# EasyEDA Pro project 减速无刷电机FOC1.0.epro, board PCB1
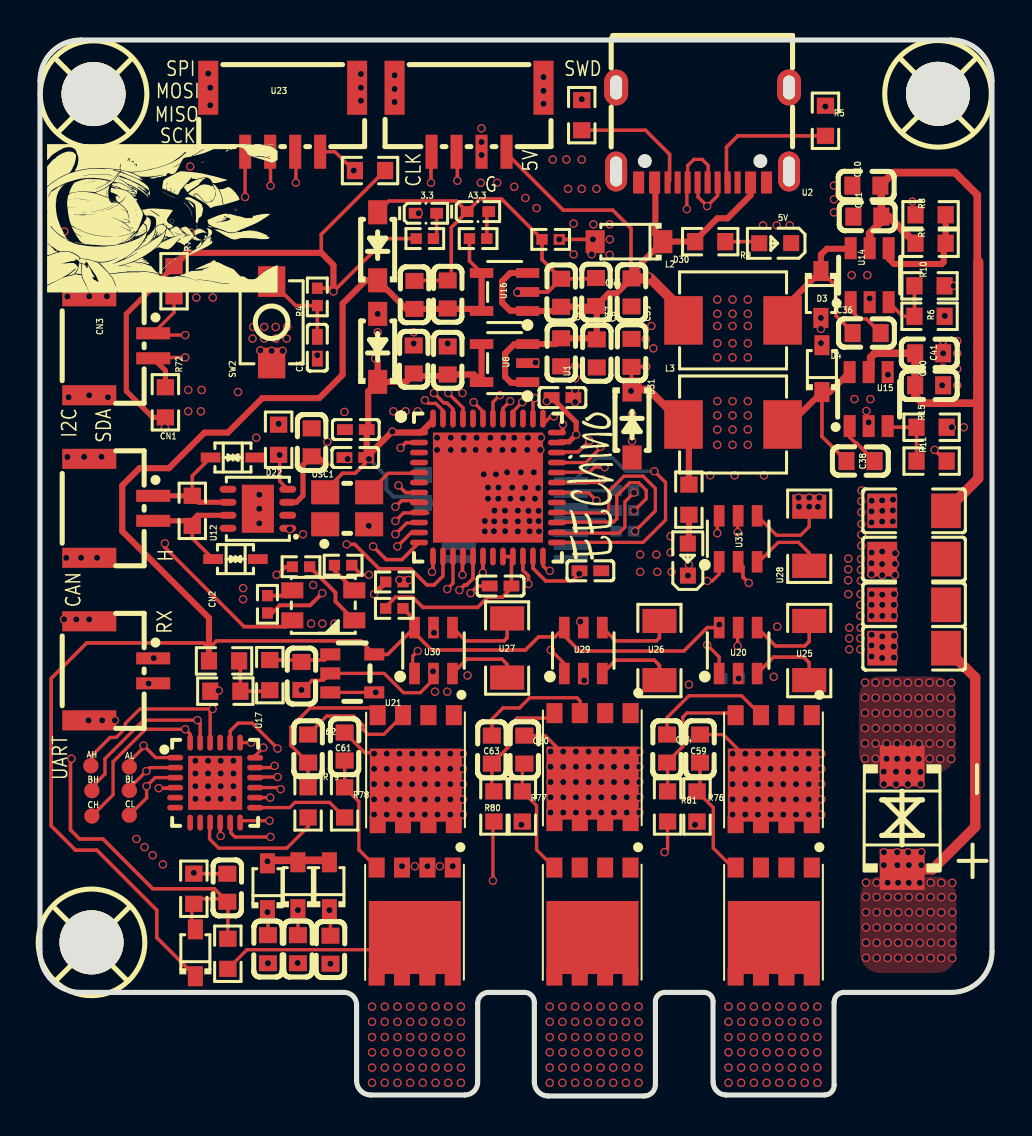
[diagram p1: board, top side]
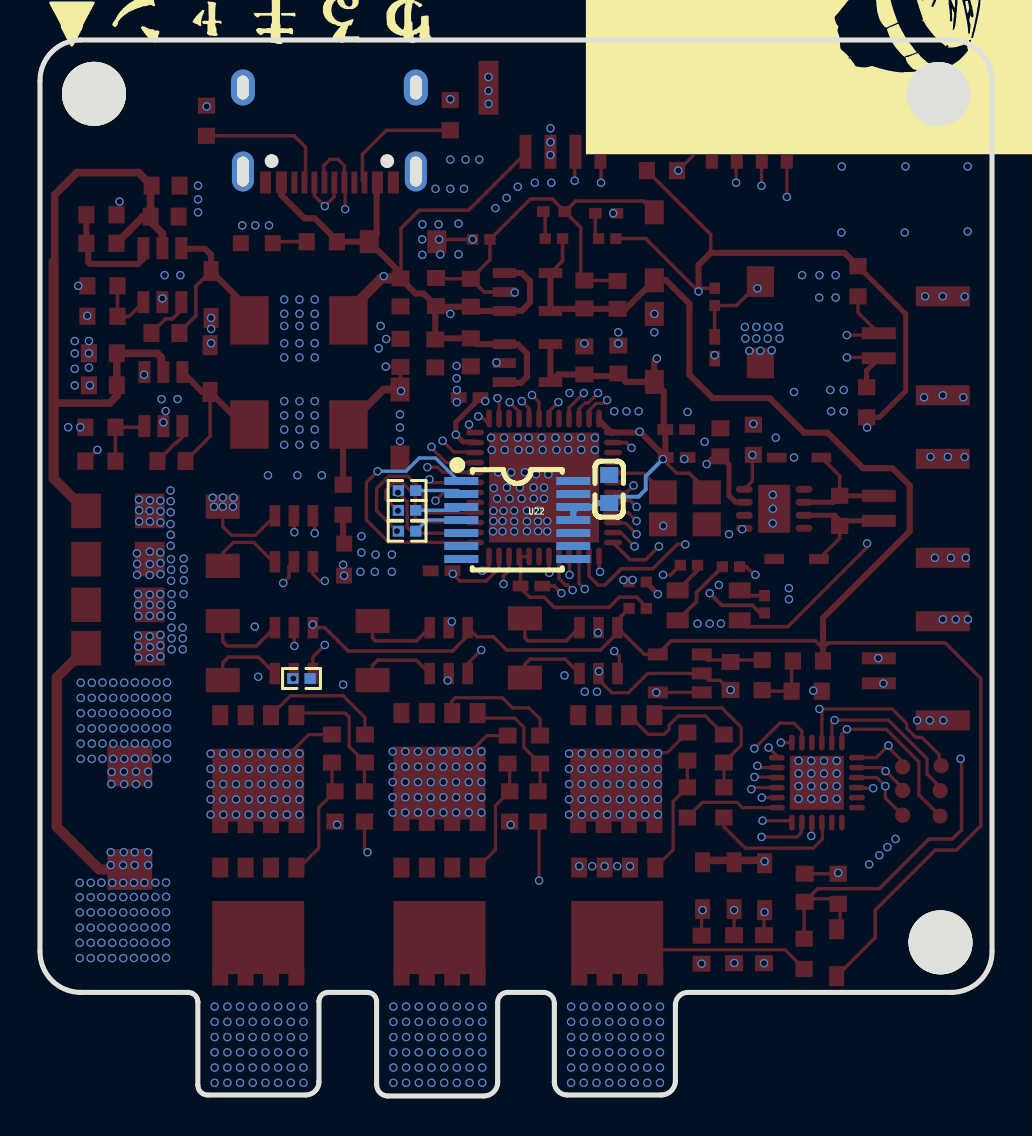
[diagram p2: board, bottom side, seen from below]

Outline 47.62 x 52.81 mm; copper layers: Top Layer, Inner1, Inner2, Bottom Layer. Coordinates in mm from the lower left corner of the outline.
Outline path: 0,50.77 0,7.21 arc(0.6,5.78) 2.03,5.18 15.21,5.18 arc(15.66,5) 15.84,4.56 15.84,0.76 arc(16.05,0.26) 16.55,0.05 21.26,0.05 arc(21.71,0.24) 21.9,0.69 21.9,4.63 arc(22.06,5.02) 22.44,5.18 24.23,5.18 arc(24.58,5.04) 24.73,4.69 24.73,0.7 arc(24.93,0.2) 25.43,0 30.22,0 arc(30.62,0.17) 30.78,0.57 30.78,4.71 arc(30.92,5.04) 31.25,5.18 33.21,5.18 arc(33.54,5.05) 33.67,4.73 33.67,0.71 arc(33.86,0.24) 34.33,0.05 39.24,0.05 arc(39.58,0.19) 39.73,0.53 39.73,4.69 arc(39.87,5.04) 40.22,5.18 45.59,5.18 arc(47.03,5.78) 47.62,7.21 47.62,50.77 arc(47.03,52.21) 45.59,52.81 2.03,52.81 arc(0.6,52.21) 0,50.77
Stack: Top Layer 0.035mm 外层铜厚1oz / Dielectric1 0.2104mm 7628 RC49% 8.6mil / Inner1 0.0152mm 内层铜厚 / Dielectric2 1.065mm 1.1mm H/HOZ 含铜 / Inner2 0.0152mm 内层铜厚 / Dielectric3 0.2104mm 7628 RC49% 8.6mil / Bottom Layer 0.035mm 外层铜厚1oz

## Design rules (mm)
template: 自定义配置
spacing copperThickness1oz (default): track to track 0.102, other pairs 0.152 to 0.3
spacing copperThickness2oz: track to track 0.203, other pairs 0.152 to 0.3
track width copperThickness1oz (default): min 0.127, default 0.254, max 2.54
track width copperThickness2oz: min 0.203, default 0.254, max 2.54
differential pair differentialPair (default): width min 0.127, default 0.254, max 2.54; gap min 0.152, default 0.152
via viaSize (default): diameter min 0.409, default 0.409, max 10; hole min 0.3, default 0.305, max 6.299
pour e147 uses copperRegion
pour e206 uses copperRegion
pour e208 uses copperRegion
pour e547 uses copperRegion
pour e636 uses copperRegion
pour e638 uses copperRegion
pour e2378 uses copperRegion
pour e2946 uses copperRegion
pour e2948 uses copperRegion
pour e4550 uses copperRegion
pour e4593 uses copperRegion
pour e4630 uses copperRegion

## Placement (name value [footprint] x y rotation side)
3.3  -  [LED_0402]  19.31 44.14 0 top
5V  LTST-C191KRKT  [LED0603-RD]  36.78 42.65 180 top
A3.3  -  [LED_0402]  21.91 44.22 0 top
AH  -  [test-point-0.5mm]  2.55 16.52 0 top
AL  -  [test-point-0.5mm]  4.47 16.46 0 top
BH  -  [test-point-0.5mm]  2.6 15.27 0 top
BL  -  [test-point-0.5mm]  4.47 15.28 0 top
C3  100nF  [C0402]  13.87 37.42 90 top
C7  100nF  [C0603]  18.69 36.83 270 top
C8  10uF  [C0603]  27.85 37.13 270 top
C10  4.7uF  [C0603]  41.34 45.52 0 top
C11  10uF  [C0603]  41.39 43.98 0 top
C25  100nF  [C0603]  26.07 37.19 270 top
C26  10uF  [C0603]  20.39 36.78 270 top
C35  100nF  [C0603]  13.59 32.69 90 top
C36  100nF  [C0603]  41.35 38.15 0 top
C37  10uF  [C0603]  29.59 40.18 90 top
C38  100nF  [C0603]  41.05 31.75 0 top
C39  10uF  [C0603]  29.59 37.16 270 top
C40  4.7uF  [C0603]  44.48 35.54 180 top
C41  10uF  [C0603]  44.48 37.14 180 top
C42  100nF  [C0603]  26.07 40.17 90 top
C43  10uF  [C0603]  20.39 40.08 270 top
C44  100nF  [C0603]  18.73 40.06 270 top
C45  10uF  [C0603]  27.81 40.21 90 top
C55  100nF  [C0603]  19.15 30.35 90 bottom
C56  100nF  [C0603]  14.53 7.32 270 top
C57  100nF  [C0603]  12.9 7.34 270 top
C58  100nF  [C0603]  11.4 7.34 270 top
C59  1nF  [C0603]  33.02 17.37 90 top
C60  1nF  [C0603]  24.23 17.32 90 top
C61  1nF  [C0603]  15.24 17.48 90 top
C62  1nF  [C0603]  13.42 17.37 90 top
C63  1nF  [C0603]  22.61 17.32 90 top
C64  1nF  [C0603]  31.37 17.37 90 top
C65  100nF  [C0603]  13.08 21.01 90 top
C70  100nF  [C0603]  9.37 10.41 90 top
C71  100nF  [C0402]  26.14 34.92 180 top
C72  100nF  [C0402]  27.53 26.26 180 top
C73  100nF  [C0402]  15.77 31.93 0 top
C74  4.7uF  [C0402]  15.8 33.32 0 top
C75  100nF  [C0402]  23.04 25.5 0 top
C78  100uF  [C1206]  43.73 29.26 0 top
C79  100uF  [C1206]  43.73 22.39 0 top
C80  100uF  [C1206]  43.73 24.56 0 top
C81  100uF  [C1206]  43.73 26.85 0 top
CH  -  [test-point-0.5mm]  2.6 14 0 top
CL  -  [test-point-0.5mm]  4.47 14.04 0 top
CN1  GH1.25-2P卧贴  [CONN-SMD_2P-P1.25_X1251WRS-02HF-LPSW]  4.06 29.39 270 top
CN2  GH1.25-2P卧贴  [CONN-SMD_2P-P1.25_X1251WRS-02HF-LPSW]  4.06 21.26 270 top
CN3  GH1.25-2P卧贴  [CONN-SMD_2P-P1.25_X1251WRS-02HF-LPSW]  4.06 37.52 270 top
D3  1N5819WS  [SOD-323_L1.8-W1.3-LS2.5-RD]  39.06 40.08 270 top
D4  1N5819WS  [SOD-323_L1.8-W1.3-LS2.5-RD]  39.12 36.37 90 top
D21  PESD3V3L1BA-N  [SOD-323_L1.8-W1.3-LS2.5-BI]  9.78 26.85 0 top
D22  PESD3V3L1BA-N  [SOD-323_L1.8-W1.3-LS2.5-BI]  9.65 31.93 180 top
D24  BZT52C3V3  [SOD-123_L2.7-W1.6-LS3.7-RD-1]  16.89 37.41 90 top
D25  BZT52C3V3  [SOD-123_L2.7-W1.6-LS3.7-RD-1]  16.89 42.49 90 top
D26  1N5819WS  [SOD-323_L1.8-W1.3-LS2.5-RD]  14.48 10.52 90 top
D27  1N5819WS  [SOD-323_L1.8-W1.3-LS2.5-RD]  12.9 10.52 90 top
D28  1N5819WS  [SOD-323_L1.8-W1.3-LS2.5-RD]  11.38 10.46 90 top
D30  BZT52C5V1  [SOD-123_L2.8-W1.8-LS3.7-RD-1]  29.46 42.72 180 top
D31  BZT52C13  [SOD-123_L2.7-W1.6-LS3.7-RD-1]  29.62 33.63 270 top
D32  1N5819WS  [SOD-323_L1.8-W1.3-LS2.5-RD]  7.77 7.16 90 top
D33  SMBJ18CA  [SMB_L4.6-W3.6-LS5.3-BI]  43.13 13.92 270 top
L2  4.7uH  [IND-SMD_L5.2-W4.7_GPSR0520]  34.67 38.79 0 top
L3  4.7uH  [IND-SMD_L5.2-W4.7_GPSR0520]  34.67 33.58 0 top
LED4  LTST-C191KRKT  [LED0603-RD]  32.41 26.82 90 top
LED7  XL-3528RGBW-HM  [LED-SMD_4P-L3.2-W2.8-LS3.5-BL-CW]  14.17 24.54 0 top
OSC1  8MHz  [OSC-SMD_4P-L3.2-W2.5-BL-1]  15.37 29.39 0 top
Q11  CJAC40N04  [CY_PDFNWB-8L_L5.8-W4.9-P1.27-BL-EP]  36.7 8.69 180 top
Q16  CJAC40N04  [CY_PDFNWB-8L_L5.8-W4.9-P1.27-BL-EP]  36.7 16.31 180 top
Q17  CJAC40N04  [CY_PDFNWB-8L_L5.8-W4.9-P1.27-BL-EP]  27.64 16.41 180 top
Q18  CJAC40N04  [CY_PDFNWB-8L_L5.8-W4.9-P1.27-BL-EP]  27.63 8.69 180 top
Q19  CJAC40N04  [CY_PDFNWB-8L_L5.8-W4.9-P1.27-BL-EP]  18.75 8.69 180 top
Q20  CJAC40N04  [CY_PDFNWB-8L_L5.8-W4.9-P1.27-BL-EP]  18.8 16.31 180 top
R4  10K  [R0402]  13.87 39.96 90 top
R5  5.1K  [R0603]  39.29 48.77 90 top
R6  124K  [R0603]  44.5 38.99 0 top
R7  100K  [R0603]  44.55 42.64 180 top
R8  100K  [R0603]  44.55 44.07 180 top
R9  10K  [R0603]  33.53 42.72 180 top
R10  23k  [R0603]  44.5 40.51 180 top
R11  124K  [R0603]  44.6 31.75 0 top
R14  10K  [R0603]  32.46 29.82 90 top
R15  8.87K  [R0603]  44.6 33.44 180 top
R40  120Ω  [R0603]  7.62 29.26 270 top
R50  10K  [R0402]  19.25 42.88 180 top
R51  10K  [R0402]  21.92 42.88 180 top
R52  0R  [R0402]  17.73 25.7 180 top
R65  0R  [R0402]  29.26 30.28 180 bottom
R66  0R  [R0402]  29.26 29.29 180 bottom
R67  0R  [R0402]  29.26 28.24 180 bottom
R68  10K  [R0402]  11.38 24.59 270 top
R69  10K  [R0402]  15.16 26.54 0 top
R70  10K  [R0402]  13.06 26.47 0 top
R71  10K  [R0603]  6.71 40.74 270 top
R72  10K  [R0603]  6.27 34.69 270 top
R73  5.1K  [R0603]  27.1 49.05 270 top
R74  10K  [R0603]  16.51 46.28 0 top
R75  10K  [R0603]  11.94 32.82 90 top
R76  22R  [R0603]  32.87 14.48 90 top
R77  22R  [R0603]  24.13 14.48 90 top
R78  22R  [R0603]  15.24 14.68 90 top
R79  22R  [R0603]  13.41 14.68 90 top
R80  22R  [R0603]  22.71 14.48 90 top
R81  22R  [R0603]  31.39 14.48 90 top
R82  10K  [R0603]  9.21 21.76 180 top
R83  10K  [R0603]  9.27 20.24 0 top
R84  0R  [R0603]  11.5 21.05 270 top
R85  15K  [R0603]  9.4 7.11 90 top
R86  2K  [R0603]  7.7 10.36 90 top
R87  10R  [R0402]  17.73 24.38 180 top
R88  0R  [R0402]  25.55 42.84 180 top
R89  0R  [R0402]  34.54 20.88 0 bottom
SCREW1  -  [M3螺丝]  2.74 50.04 0 top
SCREW2  -  [M3螺丝]  44.99 50.05 0 top
SCREW3  -  [M3螺丝]  2.64 7.62 0 top
SW2  KEY-3*4*2  [SW-SMD_L4.0-W2.9-LS5.0]  11.59 38.69 90 top
U1  STM32G431CBU6  [UFQFPN-48_L7.0-W7.0-P0.50-BL-EP]  22.41 30.43 270 top
U2  TypeC-16PIN  [USB-C-SMD_TYPE-C-6PIN-2MD-073]  33.15 48.06 180 top
U8  RT9013-33GB  [SOT-23-5_L3.0-W1.7-P0.95-LS2.8-BL]  23.24 36.65 90 top
U12  SIT1050TK  [TDFN-8_L3.0-W3.0-P0.65-BL-EP]  10.9 29.36 90 top
U14  MP2451DT-LF-Z  [SOT-23-6_L2.9-W1.6-P0.95-LS2.8-BR]  41.5 41.05 270 top
U15  MP2451DT-LF-Z  [SOT-23-6_L2.9-W1.6-P0.95-LS2.8-BR]  41.45 34.85 270 top
U16  RT9013-33GB  [SOT-23-5_L3.0-W1.7-P0.95-LS2.8-BL]  23.24 40.21 90 top
U17  FD6288Q  [QFN-24_L4.0-W4.0-P0.50-BL-EP2.7]  8.76 15.67 270 top
U20  INA181A1IDBVR  [SOT-23-6_L2.9-W1.6-P0.95-LS2.8-TL]  34.93 22.28 90 top
U21  LM321  [SOT-23-5_L2.9-W1.6-P0.95-LS2.8-BR]  15.62 21.13 180 top
U22  AS5047P-ATSM  [TSSOP-14_L5.0-W4.4-P0.65-LS6.4-BL]  23.75 28.8 270 bottom
U23  GH1.25-4P  [CONN-SMD_GH1.25-4P]  12.14 48.82 180 top
U24  GH1.25-4P  [CONN-SMD_GH1.25-4P]  21.46 48.82 180 top
U25  10mΩ  [R1206]  38.48 22.28 270 top
U26  10mΩ  [R1206]  30.99 22.28 270 top
U27  10mΩ  [R1206]  23.37 22.4 270 top
U28  10mΩ  [R1206]  38.48 27.99 90 top
U29  INA181A1IDBVR  [SOT-23-6_L2.9-W1.6-P0.95-LS2.8-TL]  27.18 22.28 90 top
U30  INA181A1IDBVR  [SOT-23-6_L2.9-W1.6-P0.95-LS2.8-TL]  19.69 22.28 90 top
U31  INA181A1IDBVR  [SOT-23-6_L2.9-W1.6-P0.95-LS2.8-TL]  34.93 27.86 90 top

## Footprints (pads in the part's own frame, mm; a bottom-side part is the same pattern mirrored in y, then rotated)
C0402
  rect 0.79x0.54 smd: 1(-0.545,0) 2(0.545,0)
C0603
  rect 0.8x0.9 smd: 1(-0.7,0) 2(0.7,0)
C1206
  rect 1.485x1.728 smd: 1(-1.593,0) 2(1.593,0)
CONN-SMD_2P-P1.25_X1251WRS-02HF-LPSW
  rect 0.6x1.7 smd: 1(-0.625,1.6) 2(0.625,1.6)
  rect 1x2.7 smd: 3(2.475,-1.6) 4(-2.475,-1.6)
CONN-SMD_GH1.25-4P
  rect 0.6x1.7 smd: 1(-1.875,1.6) 2(-0.625,1.6) 3(0.625,1.6) 4(1.875,1.6)
  rect 1x2.7 smd: 5(-3.725,-1.6) 6(3.725,-1.6)
CY_PDFNWB-8L_L5.8-W4.9-P1.27-BL-EP
  rect 0.8x1 smd: 1(-1.905,-2.737) 2(-0.635,-2.737) 3(0.635,-2.737) 4(1.905,-2.737)
  rect 0.8x0.85 smd: 5(1.905,2.737) 6(0.635,2.737) 7(-0.635,2.737) 8(-1.905,2.737)
  rect 4.6x3.65 smd: 8(-0.005,0.76)
IND-SMD_L5.2-W4.7_GPSR0520
  rect 1.924x2.42 smd: 1(2.478,0) 2(-2.478,0)
LED0603-RD
  rect 0.8x0.8 smd: 1(-0.799,-0.004) 2(0.799,0.004)
LED-SMD_4P-L3.2-W2.8-LS3.5-BL-CW
  rect 1.1x0.8 smd: 1(-1.55,-0.75) 2(-1.55,0.75) 3(1.55,0.75) 4(1.55,-0.75)
LED_0402
  rect 0.637x0.541 smd: 1(-0.538,0) 2(0.538,0)
M3螺丝
  round 3.2 hole 3.2: 1(-0.064,0.064)
OSC-SMD_4P-L3.2-W2.5-BL-1
  rect 1.4x1.2 smd: 1(-1.1,-0.8) 2(1.1,-0.8) 3(1.1,0.8) 4(-1.1,0.8)
QFN-24_L4.0-W4.0-P0.50-BL-EP2.7
  oval 0.28x0.8 smd: 1(-1.25,-2) 2(-0.75,-2) 3(-0.25,-2) 4(0.25,-2) 5(0.75,-2) 6(1.25,-2) 13(1.25,2) 14(0.75,2) 15(0.25,2) 16(-0.25,2) 17(-0.75,2) 18(-1.242,2)
  oval 0.8x0.28 smd: 7(2,-1.25) 8(2,-0.75) 9(2,-0.25) 10(2,0.25) 11(2,0.75) 12(2,1.25) 19(-2,1.25) 20(-2,0.75) 21(-2,0.25) 22(-2,-0.25) 23(-2,-0.75) 24(-2,-1.25)
  rect 2.7x2.7 smd: 25(0.013,0)
R0402
  rect 0.566x0.54 smd: 1(-0.433,0) 2(0.433,0)
R0603
  rect 0.806x0.864 smd: 1(-0.753,0) 2(0.753,0)
R1206
  rect 1.208x1.701 smd: 1(-1.479,0) 2(1.479,0)
SMB_L4.6-W3.6-LS5.3-BI
  rect 2.047x2.241 smd: 1(-2.591,0) 2(2.591,0)
SOD-123_L2.7-W1.6-LS3.7-RD-1
  rect 1.2x0.95 smd: 1(-1.7,0) 2(1.7,0)
SOD-123_L2.8-W1.8-LS3.7-RD-1
  rect 0.95x1.15 smd: 1(-1.692,0) 2(1.692,0)
SOD-323_L1.8-W1.3-LS2.5-BI
  rect 0.985x0.49 smd: 1(-1.117,0) 2(1.117,0)
SOD-323_L1.8-W1.3-LS2.5-RD
  rect 1x0.75 smd: 1(-1.173,0) 2(1.173,0)
SOT-23-5_L2.9-W1.6-P0.95-LS2.8-BR
  rect 1x0.6 smd: 1(1.1,-0.95) 2(1.1,0) 3(1.1,0.95) 4(-1.1,0.95) 5(-1.1,-0.95)
SOT-23-5_L3.0-W1.7-P0.95-LS2.8-BL
  rect 0.49x1.157 smd: 1(-0.95,-1.153) 2(0,-1.153) 3(0.95,-1.153)
  rect 0.49x1.175 smd: 4(0.95,1.153) 5(-0.95,1.153)
SOT-23-6_L2.9-W1.6-P0.95-LS2.8-BR
  rect 1.1x0.6 smd: 1(1.35,-0.95) 2(1.35,0) 3(1.35,0.95) 4(-1.35,0.95) 5(-1.35,0) 6(-1.35,-0.95)
SOT-23-6_L2.9-W1.6-P0.95-LS2.8-TL
  rect 1.072x0.532 smd: 1(-1.149,0.95) 2(-1.149,0) 3(-1.149,-0.95) 4(1.149,-0.95) 5(1.149,0) 6(1.149,0.95)
SW-SMD_L4.0-W2.9-LS5.0
  rect 1.53x1.36 smd: 1(-2.035,0) 2(2.035,0)
TDFN-8_L3.0-W3.0-P0.65-BL-EP
  oval 0.35x0.84 smd: 1(-0.975,-1.495) 2(-0.325,-1.495) 3(0.325,-1.495) 4(0.975,-1.495) 5(0.975,1.495) 6(0.325,1.495) 7(-0.325,1.495) 8(-0.975,1.495)
  rect 2.4x1.6 smd: 9(0,0)
test-point-0.5mm
  round 0.762 smd: 1(0,0)
TSSOP-14_L5.0-W4.4-P0.65-LS6.4-BL
  rect 0.4x1.7 smd: 1(-1.95,-2.8) 2(-1.3,-2.8) 3(-0.65,-2.8) 4(0,-2.8) 5(0.65,-2.8) 6(1.3,-2.8) 7(1.95,-2.8) 8(1.95,2.8) 9(1.3,2.8) 10(0.65,2.8) 11(0,2.8) 12(-0.65,2.8) 13(-1.3,2.8) 14(-1.95,2.8)
UFQFPN-48_L7.0-W7.0-P0.50-BL-EP
  oval 0.28x0.9 smd: 1(-2.751,-3.45) 2(-2.251,-3.45) 3(-1.75,-3.45) 4(-1.25,-3.45) 5(-0.749,-3.45) 6(-0.249,-3.45) 7(0.249,-3.45) 8(0.75,-3.45) 9(1.25,-3.45) 10(1.75,-3.45) 11(2.251,-3.45) 12(2.751,-3.45) 25(2.751,3.449) 26(2.251,3.449) 27(1.75,3.449) 28(1.25,3.449) 29(0.75,3.449) 30(0.249,3.449) 31(-0.249,3.449) 32(-0.749,3.449) 33(-1.25,3.449) 34(-1.75,3.449) 35(-2.251,3.449) 36(-2.751,3.449)
  oval 0.9x0.28 smd: 13(3.45,-2.751) 14(3.45,-2.251) 15(3.45,-1.75) 16(3.45,-1.25) 17(3.45,-0.75) 18(3.45,-0.249) 19(3.45,0.249) 20(3.45,0.749) 21(3.45,1.25) 22(3.45,1.75) 23(3.45,2.251) 24(3.45,2.751) 37(-3.449,2.751) 38(-3.449,2.251) 39(-3.449,1.75) 40(-3.449,1.25) 41(-3.449,0.749) 42(-3.449,0.249) 43(-3.449,-0.249) 44(-3.449,-0.75) 45(-3.449,-1.25) 46(-3.449,-1.75) 47(-3.449,-2.251) 48(-3.449,-2.751)
  rect 5.5x5.5 smd: 49(0,0)
USB-C-SMD_TYPE-C-6PIN-2MD-073
  rect 0.55x1.1 smd: 1(-3.2,2.375) 2(-2.4,2.375) 11(2.4,2.375) 12(3.2,2.375)
  rect 0.3x1.1 smd: 3(-1.75,2.375) 4(-1.25,2.375) 5(-0.75,2.375) 6(-0.25,2.375) 7(0.25,2.375) 8(0.75,2.375) 9(1.25,2.375) 10(1.75,2.375)
  oval 1.1x2 hole 0.6x1.5: 13(-4.325,1.825) 14(4.325,1.825)
  oval 1.2x1.8 hole 0.6x1.2: 13(-4.325,-2.375) 14(4.325,-2.375)

## Nets
As in the schematic, except:
AGND: A3.3.1 C42.2 C43.1 C44.1 C45.2 C65.1 C70.2 C75.1 D25.2 R52.2 R83.1 R86.2 R88.2 R89.2 U16.2 U20.2 U21.2 U29.2 U30.2 U31.2
GND: 3.3.1 5V.1 C3.1 C7.1 C8.2 C10.1 C11.1 C25.2 C26.1 C35.2 C37.1 C39.1 C40.1 C41.1 C55.2 C71.1 C72.1 C73.1 C74.1 C78.1 C79.1 C80.1 C81.1 CN1.3 CN1.4 CN2.3 CN2.4 CN3.3 CN3.4 D3.2 D4.2 D21.2 D22.1 D24.2 D30.2 D31.2 D33.1 LED4.1 OSC1.2 R5.2 R8.2 R10.1 R15.1 R52.1 R73.1 R75.2 R88.1 R89.1 SW2.1 U1.49 U2.1 U2.12 U2.13 U2.14 U8.2 U12.2 U12.8 U12.9 U14.2 U15.2 U17.6 U17.25 U22.13 U23.5 U23.6 U24.2 U24.5 U24.6 U28.2 U31.4
$1N862: 5V.2 R9.1
$1N2053: 3.3.2 R50.1
$1N2347: A3.3.2 R51.1

Pads without a net: OSC1 1; SCREW1 1; SCREW2 1; SCREW3 1; U1 3 4 6 19 29 39 44; U2 3 9; U12 5; U17 5 7 8 21; U22 5 6 7 8 9 10 14

## Via types
v1: diameter 0.419, hole 0.305, Top Layer to Bottom Layer, 842 vias

## Routing (per net, layer and track width the routed paths; a pad name or vN(x,y) marks a point on that pad's centre or on a via; arc(x,y) is an arc through that point)
5V: length 81.8
  Top Layer w0.178: 29.87,40.88 29.98,41 v1(30.43,41) ; C37.2 29.57,40.91 29.57,43.38 28.65,44.3 26.18,44.3 23.34,47.14 U24.1 ; R6.2 45.26,39 v1(45.26,39.01)
  Top Layer w0.254: v1(14.28,31.6) 13.89,31.99 C35.1 13.16,31.55 13.16,30.02 12.82,29.69 12.4,29.69
  Top Layer w0.305: D30.1 R9.2 32.77,42.78 33.88,43.89 34.4,43.89 35.55,45.04 U2.2 ; D30.1 30.78,43.09 30.78,45.64 U2.11 ; D30.1 29.59,41.16 ; 29.59,41.16 C37.2 28.84,40.13 28.44,40.13 C45.1 ; 29.59,41.16 29.87,40.88 ; C45.1 27.85,39.47 C8.1 27.79,37.89 C25.1 25.78,37.6 U8.3 23.73,37.6 23.27,37.13 23.27,35.97 23.57,35.66 24.36,35.66 U8.1 ; C45.1 27.78,39.47 27.46,39.47 ; 27.46,39.47 C42.1 25.86,39.26 U16.1 24.38,39.27 23.52,39.27 23.11,39.67 23.11,40.74 23.53,41.16 U16.3 ; 27.46,39.47 v1(27.1,39.11)
  Top Layer w0.508: 29.87,40.88 30.54,40.88 32.19,39.23 L2.2
  Inner2 w0.178: v1(30.43,41) 31.85,41 32.36,41.5 42.01,41.5 44.45,39.07 45.21,39.07 v1(45.26,39.01)
  Inner2 w0.254: v1(14.28,31.6) 18.34,35.66 20.27,35.66 23.27,38.66 26.65,38.66 v1(27.1,39.11)
12V: length 88.7
  Top Layer w0.178: 11.33,11.79 v1(11.38,11.73) D28.2 ; v1(30.33,36.47) 29.6,36.47 C39.2 29.59,35.35 D31.1 29.62,35.31 v1(29.57,35.26) ; v1(5.94,15.39) 6.73,15.39 U17.4 ; v1(44.75,32.31) 45.31,31.75 R11.2
  Top Layer w0.305: L3.2 32.46,33.31 R14.2
  Top Layer w0.381: L3.2 30.44,35.33 D31.1 ; 12.81,11.79 14.38,11.79 D26.2 ; 12.81,11.79 11.33,11.79 ; 12.81,11.79 D27.2
  Inner1 w0.381: 11.33,11.79 11.18,11.94 7.52,11.94 5.94,13.51 v1(5.94,15.39)
  Inner2 w0.178: v1(30.33,36.47) 36.83,36.47 38.3,35 38.3,34.65 40.13,32.82 44.25,32.82 v1(44.75,32.31)
  Inner2 w0.381: v1(29.57,35.26) 29.57,37.9 25.65,41.81 11.94,41.81 9.04,38.91 9.04,23.46 5.94,20.36 v1(5.94,15.39)
AGND: length 116.6
  Top Layer w0.165: v1(19.66,21.23) 19.66,20.8 19.03,20.17 18.19,20.17 17.22,21.13 14.52,21.13 14.18,20.79 13.61,20.79 13.13,20.31 v1(13.08,20.31)
  Top Layer w0.178: v1(21.54,25.15) 21.9,25.5 22.49,25.5 ; v1(23.88,40.18) 24.37,40.18 U16.2 25.41,40.21 C42.2 ; v1(27.23,20.78) 27.23,21.08 U29.2 ; v1(8.94,20.27) 8.92,20.24 R83.1 ; R86.2 9.37,11.12 C70.2 ; A3.3.1 20.57,43.43 20.57,40.96 C43.1 18.76,40.78 C44.1 ; A3.3.1 22,44.86 23.09,44.86 25.11,42.84 25.11,41.83 C42.2 ; A3.3.1 21.36,44.22 20.83,44.75 17.46,44.75 D25.2 ; C42.2 27.78,40.87 C45.2 ; v1(35.46,25.65) 35.17,25.95 35.17,26.47 U31.2 ; U20.2 34.95,21.1 v1(34.95,20.88)
  Top Layer w0.254: v1(16.71,25.1) 17.3,25.68 R52.2
  Inner1 w0.178: v1(13.16,28.09) 13.56,28.5 13.56,31.9 v1(14.38,32.72)
  Inner2 w0.165: v1(21.54,25.15) 20.17,23.77 20.17,21.74
  Inner2 w0.178: v1(14.38,32.72) 14.58,32.92 14.58,34.44 16.15,36.02 17.83,36.02 20.12,38.3 22,38.3 v1(23.88,40.18) ; 10.36,20.27 7.06,16.97 7.06,11.79 v1(7.7,11.16) ; 10.36,20.27 v1(8.94,20.27) ; 10.36,20.27 13.06,20.27 13.87,21.08 17.37,21.08 18.19,20.27 19,20.27 19.66,20.93 v1(19.66,21.23) 20.37,21.95 24.18,21.95 25.35,20.78 v1(27.23,20.78) 28.35,20.78 29.46,21.89 32,21.89 33.02,20.88 v1(34.95,20.88) 35.61,21.54 35.61,25.5 v1(35.46,25.65) ; v1(13.16,28.09) 13.16,24.54 13.46,24.23 15.85,24.23 v1(16.71,25.1)
  Inner2 w0.254: v1(16.71,25.1) 16.71,23.06 18.49,21.29 19.61,21.29 v1(19.66,21.23)
AVCC3V3: length 102.4
  Top Layer w0.165: v1(33.88,28.14) 33.88,28.92 U31.6 ; U20.6 33.97,23.56 v1(33.99,23.57)
  Top Layer w0.178: U30.6 18.74,23.15 19.59,22.3 24.28,22.3 24.94,22.96 25.76,22.96 U29.6 26.23,23.02 26.99,22.25 32.21,22.25 33.38,23.42 U20.6 ; U30.6 17.39,22.08 U21.5 16.05,22.76 8.83,22.76 8.46,22.38 8.18,22.66 2.34,22.66 0.56,20.88 0.56,13.51 1.78,12.29 2.84,12.29 5.84,9.3 5.84,7.92 D32.1 ; U30.6 18.74,23.81 R87.1 ; U16.4 21.49,41.76 R51.2
  Top Layer w0.305: U16.4 U16.5 21.98,39.36 C44.2 18.32,39.36 D25.1 16.31,40.79 15.14,39.62 15.14,36.07 13.97,34.9 11.12,34.9 9.4,33.17 8.23,33.17 6.45,31.39 4.98,31.39 4.11,30.53 4.11,28.24 8.46,23.9 8.46,21.76
  Inner2 w0.165: v1(33.99,23.57) 34.04,23.62 34.04,25.7 33.88,25.86 v1(33.88,28.14)
GND: length 6
  Top Layer w0.165: v1(38.48,29.47) 38.48,28.47 38.05,28.04 36.85,28.04 U31.4
  Top Layer w0.178: D30.2 v1(27.66,42.84) v1(25.98,42.84)
  vias: v1(1.22,46.48) v1(1.22,43.23) v1(1.2,23.83) v1(1.37,39.98) v1(1.37,31.95) v1(1.31,26.91) v1(1.44,34.94) v1(1.82,23.83) v1(2.06,26.91) v1(2.21,31.96) v1(2.46,39.99) v1(2.46,35.04) v1(2.46,23.83) v1(2.43,18.78) v1(2.86,26.91) v1(3.08,31.96) v1(3.11,18.78) v1(3.35,39.99) v1(3.4,34.94) v1(3.75,18.78) v1(4.33,46.48) v1(4.37,43.18) v1(4.83,12.85) v1(5.23,12.45) v1(5.64,12.04) v1(6.15,11.58) v1(7.42,35.31) v1(7.42,34.24) v1(7.52,46.48) v1(7.54,43.18) v1(7.77,16.76) v1(7.77,16.13) v1(7.77,15.49) v1(7.77,14.86) v1(7.82,41.05) v1(7.82,39.93) v1(8.09,35.31) v1(8.05,34.24) v1(8.42,51.13) v1(8.41,16.76) v1(8.41,16.13) v1(8.41,15.49) v1(8.41,14.86) v1(8.52,50.42) v1(8.52,49.54) v1(8.63,41.05) v1(8.64,39.93) v1(9.04,16.76) v1(9.04,16.13) v1(9.04,15.49) v1(9.04,14.86) v1(9.5,41.05) v1(9.68,16.76) v1(9.68,16.13) v1(9.68,15.49) v1(9.68,14.86) v1(9.91,35.2) v1(9.91,31.93) v1(10.16,25.4) v1(10.16,24.84) v1(10.67,38.46) v1(10.63,37.88) v1(10.82,32.92) v1(10.97,30.07) v1(10.97,29.36) v1(10.97,28.64) v1(11.02,37.29) v1(11.22,38.46) v1(11.22,37.88) v1(11.59,37.26) v1(11.79,38.46) v1(11.79,37.88) v1(11.94,33.61) v1(12.14,37.26) v1(12.36,38.46) v1(12.34,37.88) v1(13.56,23.62) v1(13.66,25.55) v1(13.87,37.04) v1(14.12,23.62) v1(14.73,23.62) v1(15.23,34.21) v1(15.39,31.85) v1(16.05,51.1) v1(16.05,50.42) v1(16.05,49.77) v1(16.45,28.51) v1(16.89,39.11) v1(16.89,38.19) v1(17.68,34.24) v1(17.74,51.04) v1(17.74,50.36) v1(17.74,49.71) v1(17.98,25.81) v1(18.29,34.24) v1(18.44,25.81) v1(18.7,38.19) v1(18.69,37.63) v1(18.95,44.15) v1(18.9,34.24) v1(19.76,20.22) v1(19.86,32.92) v1(19.86,32.31) v1(20.37,20.22) v1(20.4,37.63) v1(20.55,32.92) v1(20.55,32.31) v1(21.2,32.92) v1(21.2,32.31) v1(21.39,21.03) v1(21.79,32.31) v1(21.84,32.92) v1(22.09,48.39) v1(22.09,47.71) v1(22.09,47.05) v1(22.05,45.67) v1(22.2,31.09) v1(22.25,28.75) v1(22.25,28.24) v1(22.48,32.31) v1(22.41,30.43) v1(22.41,29.87) v1(22.53,32.92) v1(22.74,29.27) v1(22.72,28.74) v1(22.71,28.24) v1(22.87,45.67) v1(22.81,31.09) v1(22.93,30.43) v1(22.93,29.87) v1(23.18,32.92) v1(23.13,32.31) v1(23.26,29.27) v1(23.27,28.74) v1(23.27,28.24) v1(23.37,31.19) v1(23.53,29.87) v1(23.69,32.31) v1(23.62,30.43) v1(23.72,45.47) v1(23.72,32.92) v1(23.91,29.27) v1(23.91,28.74) v1(23.91,28.23) v1(24.05,31.19) v1(24.14,29.87) v1(24.28,44.91) v1(24.27,30.43) v1(24.38,32.31) v1(24.41,32.92) v1(24.44,29.26) v1(24.49,28.75) v1(24.49,28.23) v1(24.79,36.68) v1(24.7,31.19) v1(24.76,29.87) v1(24.84,44.4) v1(24.92,30.4) v1(24.94,29.26) v1(24.94,28.75) v1(24.96,28.23) v1(25.06,32.92) v1(25.03,32.31) v1(25.19,50.95) v1(25.19,50.27) v1(25.19,49.62) v1(25.65,46.83) v1(26.33,46.83) v1(26.42,45.36) v1(26.69,43.63) v1(26.69,42.09) v1(26.78,36.51) v1(26.78,35.89) v1(26.77,35.31) v1(26.77,34.7) v1(27.1,49.85) v1(27.1,46.83) v1(27.1,45.36) v1(27.69,43.59) v1(27.6,42.09) v1(27.84,45.36) v1(28.5,43.59) v1(28.5,42.84) v1(28.5,42.06) v1(29.62,34.09) v1(29.62,33.43) v1(29.62,32.75) v1(30.02,27.08) v1(30.02,26.21) v1(30.31,37.86) v1(30.58,38.51) v1(30.68,37.39) v1(30.84,27.08) v1(30.88,26.21) v1(31.55,27.99) v1(31.55,27.18) v1(31.6,26.21) v1(32.46,26.57) v1(32.41,26.02) v1(32.46,20.57) v1(33.53,31.04) v1(33.88,39.83) v1(33.88,39.12) v1(33.88,38.51) v1(33.88,37.64) v1(33.88,36.93) v1(33.88,34.75) v1(33.88,34.04) v1(33.88,33.32) v1(33.88,32.56) v1(34.65,39.83) v1(34.65,39.12) v1(34.65,38.51) v1(34.65,37.64) v1(34.65,36.93) v1(34.65,34.75) v1(34.65,34.04) v1(34.65,33.32) v1(34.65,32.56) v1(34.75,31.04) v1(35.41,39.83) v1(35.41,39.12) v1(35.41,38.51) v1(35.41,37.64) v1(35.41,36.93) v1(35.41,34.75) v1(35.41,34.04) v1(35.41,33.32) v1(35.41,32.56) v1(36.17,43.54) v1(36.22,31.04) v1(36.71,20.96) v1(36.86,43.54) v1(36.88,23.47) v1(37.51,43.54) v1(37.95,29.92) v1(37.97,29.47) v1(38.48,29.92) v1(38.99,29.92) v1(38.91,29.46) v1(39.06,38.91) v1(39.06,38.36) v1(39.06,37.65) v1(39.29,49.48) v1(39.72,45.52) v1(39.72,44.84) v1(39.72,44.19) v1(40.44,26.87) v1(40.43,26.34) v1(40.43,25.79) v1(40.44,25.1) v1(40.49,23.42) v1(40.48,22.89) v1(40.48,22.33) v1(40.6,41.05) v1(40.74,34.85) v1(41.09,29.74) v1(41.09,29.19) v1(41.09,28.07) v1(41.09,27.52) v1(41.07,26.85) v1(41.06,26.31) v1(41.06,25.76) v1(41.05,25.1) v1(41.04,24.56) v1(41.04,24.01) v1(41.05,23.42) v1(41.04,22.89) v1(41.04,22.33) v1(41.1,30.28) v1(41.1,28.6) v1(41.27,20.68) v1(41.27,19.92) v1(41.27,19.16) v1(41.27,18.4) v1(41.27,17.63) v1(41.27,16.87) v1(41.39,41.05) v1(41.34,34.25) v1(41.45,33.69) v1(41.5,39.88) v1(41.54,34.85) v1(41.6,29.77) v1(41.6,29.24) v1(41.6,28.68) v1(41.6,27.18) v1(41.6,26.64) v1(41.6,26.09) v1(41.6,25.1) v1(41.6,24.56) v1(41.6,24.01) v1(41.6,23.06) v1(41.6,22.53) v1(41.6,21.98) v1(41.8,20.68) v1(41.8,19.91) v1(41.8,19.15) v1(41.8,18.39) v1(41.8,17.63) v1(41.8,16.87) v1(42.13,29.78) v1(42.13,29.26) v1(42.13,28.73) v1(42.13,27.22) v1(42.13,26.6) v1(42.13,26.05) v1(42.13,25.07) v1(42.13,24.56) v1(42.13,24.01) v1(42.13,22.98) v1(42.13,22.45) v1(42.13,21.9) v1(42.21,16.22) v1(42.22,15.6) v1(42.35,20.68) v1(42.35,19.91) v1(42.35,19.15) v1(42.35,18.39) v1(42.35,17.63) v1(42.35,16.87) v1(42.67,29.82) v1(42.66,29.29) v1(42.66,28.73) v1(42.78,27.14) v1(42.77,26.61) v1(42.77,26.06) v1(42.72,25.1) v1(42.72,24.56) v1(42.72,24.01) v1(42.72,23.01) v1(42.72,22.48) v1(42.72,21.93) v1(42.88,20.68) v1(42.88,19.91) v1(42.88,19.15) v1(42.88,18.39) v1(42.88,17.63) v1(42.88,16.87) v1(42.82,16.22) v1(42.82,15.6) v1(43.41,20.67) v1(43.41,19.91) v1(43.41,19.14) v1(43.41,18.38) v1(43.41,17.62) v1(43.41,16.86) v1(43.43,16.22) v1(43.42,15.6) v1(43.65,44.73) v1(43.96,20.67) v1(43.96,19.91) v1(43.96,19.14) v1(43.96,18.38) v1(43.96,17.62) v1(43.96,16.86) v1(44.04,16.21) v1(44.05,15.6) v1(44.5,20.68) v1(44.5,19.91) v1(44.5,19.15) v1(44.5,18.39) v1(44.5,17.63) v1(44.5,16.87) v1(45.03,20.67) v1(45.03,19.91) v1(45.03,19.14) v1(45.03,18.38) v1(45.03,17.62) v1(45.03,16.86) v1(45.18,37.75) v1(45.18,37.14) v1(45.18,36.42) v1(45.13,35.54) v1(45.59,20.67) v1(45.59,19.91) v1(45.59,19.14) v1(45.59,18.38) v1(45.59,17.62) v1(45.59,16.86) v1(45.61,33.44) v1(45.71,40.51) v1(45.88,37.75) v1(45.88,37.13) v1(45.88,36.36) v1(45.88,35.53) v1(46.21,33.44)
VBAT+: length 60.3
  Top Layer w0.165: Q19.8 18.14,7.32 10.35,7.32 R85.1
  Top Layer w0.381: R7.2 42.47,43.98 C11.2 ; C11.2 42.09,45.47 C10.2 42.69,46.18 45.77,46.18 46.89,45.06 46.89,41.76 ; C11.2 42.09,43.72 41.5,43.14 U14.5 ; U15.5 41.55,36.3 41.55,36.93 41.76,37.14 C41.2 C40.2 43.78,35.01 44.15,34.65 46.91,34.65 46.94,34.68
  Top Layer w0.508: C79.2 46.79,20.93 46.79,13.46 44.65,11.33 D33.2 ; C78.2 46.94,30.88 46.94,41.71
  vias: v1(41.32,10.68) v1(41.32,9.96) v1(41.32,9.19) v1(41.32,8.43) v1(41.32,7.67) v1(41.32,6.91) v1(41.85,10.67) v1(41.85,9.95) v1(41.85,9.19) v1(41.85,8.43) v1(41.85,7.66) v1(41.85,6.9) v1(42.22,12.19) v1(42.21,11.55) v1(42.4,10.67) v1(42.4,9.95) v1(42.4,9.19) v1(42.4,8.43) v1(42.4,7.66) v1(42.4,6.9) v1(42.88,12.19) v1(42.89,11.55) v1(42.93,10.67) v1(42.93,9.95) v1(42.93,9.19) v1(42.93,8.43) v1(42.93,7.66) v1(42.93,6.9) v1(43.43,12.19) v1(43.47,11.55) v1(43.46,10.66) v1(43.46,9.94) v1(43.46,9.18) v1(43.46,8.42) v1(43.46,7.66) v1(43.46,6.89) v1(44.09,12.19) v1(44.09,11.55) v1(44.01,10.66) v1(44.01,9.94) v1(44.01,9.18) v1(44.01,8.42) v1(44.01,7.66) v1(44.01,6.89) v1(44.55,10.67) v1(44.55,9.95) v1(44.55,9.19) v1(44.55,8.43) v1(44.55,7.66) v1(44.55,6.9) v1(45.09,10.66) v1(45.09,9.94) v1(45.09,9.18) v1(45.09,8.42) v1(45.09,7.66) v1(45.09,6.89) v1(45.64,10.66) v1(45.64,9.94) v1(45.64,9.18) v1(45.64,8.42) v1(45.64,7.66) v1(45.64,6.89)
VBUS: length 45.6
  Top Layer w0.165: 9.22,9.86 7.59,9.86 7.59,8.51 D32.2 ; R85.2 9.4,9.69 C70.1
  Top Layer w0.178: U1.14 20.16,26 19.71,25.55 19.35,25.55 18.54,26.37 16.97,26.37 15.75,27.58 v1(15.34,27.58) ; v1(1.58,16.87) 1.52,16.81 1.52,13.31 1.98,12.85 3.15,12.85 5.64,10.36 8.72,10.36 9.22,9.86 C70.1
  Inner1 w0.178: v1(15.34,27.58) 15.29,27.64 7.98,27.64 1.58,21.23 v1(1.58,16.87)
VCC3V3: length 99
  Top Layer w0.178: R72.2 6.25,33.91 v1(6.25,33.43) ; R50.2 17.32,42.88 v1(14.68,40.23) 14.52,40.39 R4.2 ; C73.2 16.26,31.87 16.26,31.62 15.77,31.14 15.14,31.14 14.27,30.27 OSC1.4 ; v1(26.97,26.11) 26.62,25.76 25.3,25.76 24.66,26.39 U1.23 ; 14.07,42.16 14.07,43.09 R74.2 ; v1(6.25,27.64) 6.25,27.43 10.21,23.47 12.31,23.47 LED7.1
  Top Layer w0.191: v1(16.46,31.85) 16.38,31.93 C73.2
  Top Layer w0.254: 26,32.72 26.47,32.72 v1(26.82,33.07) 26.82,33.69 C71.2 25.41,34.75 v1(25.35,34.75) ; R71.1 4.32,39.11 4.32,35.26 5.64,33.93 R72.2
  Top Layer w0.305: 16.34,31.95 C73.2 ; 16.34,31.95 C74.2 ; 16.34,31.95 17.57,33.18 ; D24.1 18.31,35.71 18.61,36 20.32,36 C26.2 21.71,36.08 U8.5 U8.4 ; D24.1 16.42,35.24 16.42,33.2 ; D24.1 16.89,36.75 v1(16.76,36.88) ; v1(14.68,40.23) 14.68,41.55 14.07,42.16 7.37,42.16 R71.1 ; 17.57,33.18 17.61,33.22 v1(17.63,33.22) ; 17.57,33.18 19.06,33.18 19.66,33.78 19.66,33.88
  Inner1 w0.178: v1(26.97,26.11) 26.97,32.92 v1(26.82,33.07) ; v1(6.25,33.43) v1(6.25,27.64)
  Inner1 w0.203: v1(17.63,33.22) 18.03,33.63 24.23,33.63 v1(25.35,34.75)
  Inner2 w0.254: v1(14.68,40.23) 15.85,39.07 15.85,37.8 v1(16.76,36.88)
  Bottom Layer w0.191: v1(16.46,31.85) 17.32,30.99 17.32,30.33 17.68,29.97 18.83,29.97 C55.1
  Bottom Layer w0.305: U22.11 20.95,29.24 20.74,29.45 ; 20.74,29.45 U22.12 ; 20.74,29.45 19.95,29.45 19.75,29.65 C55.1
A+: length 10.3
  Top Layer w0.165: Q16.3 35.1,20.02 32.46,20.02 31.37,18.92 C64.2
  Top Layer w0.178: U20.3 36.69,21.95 38.2,21.95 38.48,21.67 U25.2
A-: length 16.1
  Top Layer w0.165: U28.1 38.48,27.15 37.95,27.69 36.93,27.69 35.96,26.71 U31.3
  Top Layer w0.178: U20.4 36.8,22.5 38.25,22.5 38.48,22.73 U25.1 ; U27.1 23.37,22.91 23.22,22.76 21.3,22.76 U30.4 ; U29.4 28.79,22.76 30.84,22.76 30.99,22.91 U26.1
AH: length 39.1
  Top Layer w0.165: 25.86,30.18 U1.30 ; 25.86,30.18 25.76,30.18 ; 25.86,30.18 27.43,30.18 v1(27.84,29.77) ; U17.22 8.51,19.23 v1(8.64,19.35) 5,19.35 4.27,18.62 4.27,18.39 3.81,17.93 3.51,17.93 2.64,17.06 2.64,16.67 2.8,16.67
  Inner1 w0.165: v1(27.84,29.77) 28.3,29.31 28.3,24.18 23.47,19.35 v1(8.64,19.35)
AL: length 23.4
  Top Layer w0.165: v1(20.37,25.35) 20.66,25.64 20.66,26.52 ; 4.47,16.71 5.18,17.42 v1(5.18,17.53) 5.79,16.92 U17.1
  Inner1 w0.165: v1(5.18,17.53) 5.18,18.8 8.89,22.5 15.65,22.5 17.73,24.59 19.61,24.59 v1(20.37,25.35)
AS5047_CS: length 13.5
  Top Layer w0.165: U1.25 25.87,27.69 30.18,27.69 31.29,28.8 31.29,30.68 v1(30.73,31.24)
  Bottom Layer w0.165: U22.1 26.69,30.75 27.84,31.9 28.65,31.9 29.31,31.24 v1(30.73,31.24)
AS5047_MISO: length 7.1
  Top Layer w0.165: 26.13,28.7 28.69,28.7 28.85,28.87 28.85,30.02 29.5,30.67 29.94,30.67 30.33,30.29 30.33,29.87 v1(29.72,29.26)
AS5047_MOSI: length 9
  Top Layer w0.165: v1(29.77,28.24) 30.78,29.26 30.78,30.38 30.17,31 29.22,31 28.45,30.23 28.45,29.32 28.28,29.16 25.88,29.16
AS5047_SCK: length 5.5
  Top Layer w0.165: U1.26 25.89,28.14 28.96,28.14 29.26,28.45 29.26,29.72 v1(29.72,30.18)
B+: length 10.3
  Top Layer w0.165: Q17.3 27.03,19.17 27.03,19.75 26.86,19.91 24.5,19.91 23.99,19.41 23.16,19.41 22.61,18.85 C63.2
  Top Layer w0.178: U29.3 28.79,21.79 30.73,21.79 30.99,21.54 U26.2
BH: length 41
  Top Layer w0.165: v1(28.14,30.84) 27.98,30.68 U1.31 ; U17.23 8.01,18.66 v1(7.87,18.8) 5.18,18.8 3.25,16.87 3.25,16.1 2.8,15.65 2.8,15.47 BH.1
  Inner1 w0.165: v1(7.87,18.8) 23.72,18.8 28.75,23.83 28.75,30.23 v1(28.14,30.84)
BL: length 25.4
  Top Layer w0.165: U17.2 5.5,16.42 v1(5.32,16.25) 4.47,15.39 BL.1
  Top Layer w0.178: U1.17 21.66,25.88 21.34,25.55 21.23,25.55 v1(20.98,25.3)
  Inner1 w0.165: v1(20.98,25.3) 19.81,24.13 18.34,24.13 16.1,21.89 8.99,21.89 5.84,18.75 5.84,17.34 5.33,16.83 5.33,16.26
C+: length 9.8
  Top Layer w0.165: Q20.3 17.2,18.08 16.41,18.08 16.15,18.34 16.15,18.54 15.7,19 14.34,19 C62.2
  Top Layer w0.178: U27.2 23.37,21.59 23.11,21.84 21.35,21.84 U30.3
CAN1_RX: length 13.5
  Top Layer w0.165: 12.4,30.34 11.99,30.75 v1(11.99,32.05) 11.95,32.05 R75.1 ; 20.66,33.88 20.66,34.36 20.36,34.66 20.21,34.66 v1(19.71,35.15)
  Inner1 w0.165: v1(19.71,35.15) 19.56,35.31 14.17,35.31 13.51,34.65 13.51,33.58 v1(11.99,32.05)
CAN1_TX: length 13.6
  Top Layer w0.165: 20.16,33.88 20.16,34.28 19.8,34.63 19.42,34.63 v1(19.25,34.8)
  Inner1 w0.165: v1(19.25,34.8) 14.43,34.8 14.02,34.39 14.02,33.32 12.5,31.8 v1(12.5,28.35)
CAN_H: length 6.3
  Top Layer w0.178: R40.2 7.62,27.89 D21.1
  Top Layer w0.254: U12.7 7.87,29.04 7.62,28.79 R40.2 7.36,28.76 CN1.2
CAN_L: length 6.2
  Top Layer w0.178: D22.2 7.62,31.01 R40.1
  Top Layer w0.254: CN1.1 7.62,30.01 ; U12.6 7.94,29.69 R40.1
CH: length 43.4
  Top Layer w0.165: CH.1 3.66,15.06 3.66,16.71 5.28,18.34 v1(7.26,18.34) 7.51,18.09 U17.24 ; v1(28.25,31.45) 27.74,31.45 27.48,31.19 25.88,31.19 25.86,31.18
  Inner1 w0.165: v1(7.26,18.34) 24.03,18.34 29.26,23.57 29.26,30.84 28.65,31.45 v1(28.25,31.45)
CL: length 27.5
  Top Layer w0.165: U17.3 5.76,15.92 v1(5.33,15.49) 5.33,14.91 CL.1
  Top Layer w0.178: U1.18 22.16,26.17 v1(22.15,26.16)
  Inner1 w0.165: v1(22.15,26.16) 22.15,24.79 20.98,23.62 18.9,23.62 16.56,21.29 9.09,21.29 6.5,18.69 6.5,16.66 v1(5.33,15.49)
EN_12V: length 36.7
  Top Layer w0.178: U1.2 18.3,32.68 v1(18.03,32.41)
  Inner2 w0.178: v1(18.03,32.41) 18.03,32.11 18.39,31.75 27.38,31.75 27.58,31.95 43.64,31.95 44.5,31.09 45.87,31.09 46.18,31.39 46.18,32 43.49,34.7 42.88,34.7 42.42,35.15 42.42,35.97
  vias: v1(42.42,36.07)
GHA: length 27.5
  Top Layer w0.165: v1(32.77,13.56) 32.87,13.67 R76.1 ; U17.19 v1(10.57,17.67)
  Inner2 w0.165: v1(32.77,13.56) 32.16,14.17 32.16,16.76 30.53,18.39 16.21,18.39 15.49,19.1 11.71,19.1 10.57,17.96 v1(10.57,17.67)
GHB: length 16.5
  Top Layer w0.165: v1(11.89,15.95) 10.79,15.95 U17.16 ; v1(24.08,13.56) 24.08,13.67 R77.1
  Inner2 w0.165: v1(24.08,13.56) 24.08,13.11 23.77,12.8 13.78,12.8 13.61,12.97 13.61,14.83 12.5,15.95 v1(11.89,15.95)
GHC: length 4.9
  Top Layer w0.165: U17.13 12.49,14.42 12.75,14.68 14.49,14.68 R78.1
GLA: length 26.3
  Top Layer w0.165: v1(11.53,12.95) 9.75,12.95 9.55,13.16 9.55,13.63 U17.11 ; v1(31.24,12.19) 31.39,12.34 R81.1
  Inner2 w0.165: v1(31.24,12.19) 29.62,10.57 25.65,10.57 24.64,11.58 21.95,11.58 21.08,10.72 13.77,10.72 v1(11.53,12.95)
GLB: length 18.6
  Top Layer w0.165: v1(22.66,10.77) 22.66,13.67 R80.1 ; U17.10 9.01,13.03 v1(9.04,13)
  Inner2 w0.165: v1(22.66,10.77) 22.15,10.26 11.79,10.26 v1(9.04,13)
GLC: length 6.9
  Top Layer w0.165: U17.9 8.48,13.64 8.48,12.85 8.94,12.4 12.34,12.4 13.41,13.46 R79.1
I2C1_SCL: length 24.1
  Top Layer w0.165: v1(7.26,38.05) 5.76,38.05 CN3.1 6.71,39.18 R71.2 ; 24.66,33.88 24.66,34.82 v1(24.74,34.9)
  Inner1 w0.165: v1(21.13,35.15) 19.96,36.32 8.99,36.32 v1(7.26,38.05)
  Inner2 w0.165: v1(24.74,34.9) 24.13,35.51 21.39,35.51 21.13,35.26 v1(21.13,35.15)
I2C1_SDA: length 18.8
  Top Layer w0.165: v1(7.26,36.93) 5.7,36.93 CN3.2 ; 21.16,33.88 21.16,34.41 v1(20.42,35.15)
  Top Layer w0.254: R72.1 6.27,36.28 CN3.2
  Inner1 w0.165: v1(7.26,36.93) 8.38,35.81 19.76,35.81 v1(20.42,35.15)
I_A: length 22.1
  Top Layer w0.165: U1.8 18.87,29.77 18.09,29.77 v1(17.78,29.46) ; U20.1 33.97,21.96 v1(33.38,22.56)
  Inner2 w0.165: v1(17.78,29.46) 18.46,29.46
  Inner2 w0.178: v1(33.38,22.56) 31.55,24.38 24.49,24.38 23.27,25.6 23.27,26.67 22.66,27.28 20.88,27.28 19.81,28.35 19.81,28.36 18.71,29.46 18.46,29.46
I_B: length 14.5
  Top Layer w0.165: U29.1 26.23,21.63 v1(25.55,22.3) ; v1(17.78,28.75) 18.19,29.16 19.4,29.16
  Inner2 w0.165: v1(17.78,28.75) 18.65,28.75
  Inner2 w0.178: v1(25.55,22.3) 22.71,25.15 22.71,26.47 22.4,26.77 20.73,26.77 18.75,28.75 18.65,28.75
I_BUS: length 24
  Top Layer w0.165: U31.1 33.97,26.1 33.63,25.76 v1(33.38,25.76) ; v1(17.88,27.48) 18.55,28.15 18.93,28.15 U1.11
  Inner2 w0.165: v1(17.88,27.48) 17.65,27.48 17.32,27.81 17.32,29.67 17.68,30.02 18.75,30.02 18.87,29.9
  Inner2 w0.178: 18.87,29.9 20.98,27.79 23.27,27.79 26.16,24.89 32.51,24.89 v1(33.38,25.76)
I_C: length 9.9
  Top Layer w0.165: v1(18.9,22.25) 18.64,22 18.64,21.04 U30.1 ; U1.10 18.94,28.65 18.34,28.65 v1(17.78,28.09)
  Inner2 w0.165: v1(17.78,28.09) 18.64,28.09 19.1,27.64 19.1,22.45 v1(18.9,22.25)
INA_REF: length 31.1
  Top Layer w0.165: U31.5 34.9,28.99 v1(34.9,28.19) ; U29.5 27.18,23.57 v1(27.03,23.72) ; 14.52,20.18 U21.4 ; U20.5 34.9,23.4 v1(34.9,22.5)
  Inner1 w0.165: v1(16.8,20.18) 18.31,21.69 19.11,21.69 19.71,22.29 v1(19.71,23.16) 19.76,23.11 26.42,23.11 v1(27.03,23.72)
  Inner2 w0.165: v1(34.9,28.19) v1(34.9,22.5) 34.9,22.45 34.44,22 32.97,22 31.24,23.72 v1(27.03,23.72)
NRST: length 20.2
  Top Layer w0.178: U1.7 18.29,30.18 v1(17.93,30.53) ; C3.2 R4.1 12.79,39.53 SW2.2
  Inner2 w0.178: v1(17.93,30.53) 17.53,30.94 13.61,30.94 12.95,31.6 12.95,39.17 v1(11.74,40.39)
RGB1: length 5.6
  Top Layer w0.178: v1(19.61,26.21) 19.66,26.26 U1.13 ; v1(16.46,26.06) 16.08,26.06 R69.2
  Inner1 w0.178: v1(16.46,26.06) 17.17,25.35 18.75,25.35 v1(19.61,26.21)
RGB2: length 9.6
  Top Layer w0.178: v1(16.66,27.48) 17.32,26.82 18.11,26.82 U1.12
  Top Layer w0.191: v1(14.12,25.15) 13.51,24.54 11.99,24.54 11.61,24.15 R68.2
  Inner2 w0.178: v1(14.12,25.15) 16.46,27.48 v1(16.66,27.48)
RGB3: length 12.4
  Top Layer w0.178: v1(21.13,26.06) 21.13,26.95 U1.16 ; v1(11.84,26.06) 11.89,26.06 12.29,26.47 R70.1
  Inner1 w0.178: v1(11.84,26.06) 13.36,24.54 16.92,24.54 17.42,25.04 19.25,25.04 20.27,26.06 v1(21.13,26.06)
SPI3_CS: length 18.2
  Top Layer w0.165: v1(24.13,34.7) 23.66,34.23 23.66,33.88 ; v1(15.7,46.28) 14.76,47.22 U23.1
  Inner1 w0.165: v1(15.7,46.28) 24.13,37.85 v1(24.13,34.7)
SPI3_MISO: length 20.1
  Top Layer w0.165: 22.66,33.88 22.66,34.7 v1(23.01,35.05) ; U23.3 11.53,47.2 v1(11.53,45.52)
  Inner1 w0.165: v1(11.53,45.52) 12.6,44.45 15.7,44.45 22.86,37.29 22.86,35.2 v1(23.01,35.05)
SPI3_MOSI: length 20.6
  Top Layer w0.165: v1(10.26,44.96) 10.26,47.21 U23.4 ; 22.16,33.88 22.16,34.23 v1(21.69,34.7)
  Inner1 w0.165: v1(21.69,34.7) 21.69,37.54 15.6,43.64 11.58,43.64 v1(10.26,44.96)
SPI3_SCK: length 19.5
  Top Layer w0.165: v1(23.52,34.75) 23.16,34.39 23.16,33.88 ; U23.2 12.8,47.18 v1(12.8,45.67)
  Inner1 w0.165: v1(23.52,34.75) 23.52,37.54 15.75,45.31 13.16,45.31 v1(12.8,45.67)
SWDCLK: length 16.7
  Top Layer w0.165: v1(25.71,33.99) 25.55,33.99 25.11,33.54
  Top Layer w0.178: v1(19.56,45.67) 19.56,47.19 U24.4
  Inner1 w0.165: v1(25.71,33.99) 25.87,34.15 25.87,39.36 v1(19.56,45.67)
SWDIO: length 16.4
  Top Layer w0.165: v1(26.16,33.58) 26.16,33.35 25.99,33.18 25.86,33.18
  Top Layer w0.178: v1(20.88,45.77) 20.88,47.18 U24.3
  Inner1 w0.165: v1(26.16,33.58) 26.16,39.93 20.88,45.21 20.88,45.72
UART_RX: length 22.9
  Top Layer w0.178: U1.22 24.16,26.28 24.44,26.01 v1(24.44,25.6) ; v1(5.69,21.89) 5.68,21.88 CN2.1
  Inner1 w0.178: v1(24.44,25.6) 23.06,26.97 19.15,26.97 18.8,26.62 10.41,26.62 v1(5.69,21.89)
UART_TX: length 26.7
  Top Layer w0.178: v1(25.5,26.26) 25.42,26.26 25.16,26.52 ; v1(5.44,20.62) 5.65,20.62 CN2.2
  Inner1 w0.178: v1(25.5,26.26) 25.5,26.67 24.64,27.53 18.75,27.53 18.14,26.92 9.19,26.92 4.47,22.2 4.47,21.59 v1(5.44,20.62)
USB_DM: length 19.6
  Top Layer w0.165: U2.5 33.9,45.02 v1(33.38,44.5) 32.92,44.96 32.92,45.66 U2.7 ; U1.33 27.31,31.68 28.04,32.41 v1(28.04,32.46)
  Inner1 w0.165: v1(28.04,32.46) 28.04,37.13 32.77,41.86 32.77,43.89 v1(33.38,44.5)
USB_DP: length 19.8
  Top Layer w0.165: U2.6 33.43,45.71 33.43,46.53 33.12,46.84 32.72,46.84 32.4,46.52 U2.8 32.36,45.64 v1(32.36,44.35) ; U1.34 25.89,32.21 26.92,32.21 v1(27.48,32.77)
  Inner1 w0.165: v1(27.48,32.77) 27.48,37.24 32.36,42.11 v1(32.36,44.35)
VB1: length 14.5
  Top Layer w0.165: v1(14.48,9.3) D26.1 14.53,9.29 C56.1 ; v1(11.89,17.37) 10.62,18.64 9.91,18.64 9.51,18.25 U17.20
  Inner1 w0.165: v1(14.48,9.3) 14.48,15.34 12.45,17.37 v1(11.89,17.37)
VB2: length 11.2
  Top Layer w0.165: v1(11.74,16.51) 11.65,16.42 U17.17 ; C57.1 12.9,9.19 13,9.29
  Inner1 w0.165: v1(11.74,16.51) 12.34,16.51 13.97,14.88 13.97,10.36 v1(12.9,9.3)
VB3: length 8.9
  Top Layer w0.165: 11.53,14.94 v1(11.52,14.92) U17.14 ; D28.1 11.4,9.27 C58.1
  Inner1 w0.165: v1(11.52,14.92) 11.65,14.92 12.7,13.87 12.7,11.02 11.38,9.7 v1(11.38,9.19)
VS1_A: length 59.2
  Top Layer w0.165: Q16.8 34.18,18.07 C59.2 ; U17.18 10.76,17.01 v1(11.18,17.42) ; 14.63,6.71 14.62,6.71 v1(14.53,6.62)
  Inner1 w0.165: 14.94,6.86 33.96,6.86 v1(36.35,4.47) ; 14.94,6.86 15.09,7.01 15.09,15.75 13,17.83 ; 14.94,6.86 14.78,6.86 14.63,6.71 ; 13,17.83 24.99,17.83 25.2,18.03 29.92,18.03 ; 13,17.83 11.58,17.83 v1(11.18,17.42)
  vias: v1(34.44,4.47) v1(34.44,3.71) v1(34.44,2.95) v1(34.44,2.18) v1(34.44,1.42) v1(34.44,0.66) v1(34.65,17.12) v1(34.65,16.36) v1(34.65,15.6) v1(34.65,14.83) v1(34.65,14.07) v1(35.08,4.47) v1(35.08,3.71) v1(35.08,2.95) v1(35.08,2.18) v1(35.08,1.42) v1(35.08,0.66) v1(35.28,17.12) v1(35.28,16.36) v1(35.28,15.6) v1(35.28,14.83) v1(35.28,14.07) v1(35.71,4.47) v1(35.71,3.71) v1(35.71,2.95) v1(35.71,2.18) v1(35.71,1.42) v1(35.71,0.66) v1(35.92,17.12) v1(35.92,16.36) v1(35.92,15.6) v1(35.92,14.83) v1(35.92,14.07) v1(36.35,3.71) v1(36.35,2.95) v1(36.35,2.18) v1(36.35,1.42) v1(36.35,0.66) v1(36.55,17.12) v1(36.55,16.36) v1(36.55,15.6) v1(36.55,14.83) v1(36.55,14.07) v1(36.98,4.47) v1(36.98,3.71) v1(36.98,2.95) v1(36.98,2.18) v1(36.98,1.42) v1(36.98,0.66) v1(37.19,17.12) v1(37.19,16.36) v1(37.19,15.6) v1(37.19,14.83) v1(37.19,14.07) v1(37.62,4.47) v1(37.62,3.71) v1(37.62,2.95) v1(37.62,2.18) v1(37.62,1.42) v1(37.62,0.66) v1(37.82,17.12) v1(37.82,16.36) v1(37.82,15.6) v1(37.82,14.83) v1(37.82,14.07) v1(38.25,4.47) v1(38.25,3.71) v1(38.25,2.95) v1(38.25,2.18) v1(38.25,1.42) v1(38.25,0.66) v1(38.46,17.12) v1(38.46,16.36) v1(38.46,15.6) v1(38.46,14.83) v1(38.46,14.07) v1(38.89,4.47) v1(38.89,3.71) v1(38.89,2.95) v1(38.89,2.18) v1(38.89,1.42) v1(38.89,0.66) v1(39.09,17.12) v1(39.09,16.36) v1(39.09,15.6) v1(39.09,14.83) v1(39.09,14.07)
VS2_B: length 47.4
  Top Layer w0.165: v1(12.04,15.34) 11.96,15.42 U17.15 ; C60.2 25.27,18.02 Q17.8
  Inner1 w0.165: v1(12.04,15.34) 12.45,15.34 13.41,14.38 13.41,11.02 12.4,10.01 12.4,7.15 v1(12.89,6.65) 13.43,6.11 25.13,6.11 v1(26.77,4.47)
  Inner2 w0.165: v1(25.54,14.18) 25.54,13.8 23.98,12.24 13.72,12.24 12.75,13.21 12.75,14.88 12.29,15.34 v1(12.04,15.34)
  vias: v1(25.54,17.22) v1(25.54,16.46) v1(25.54,15.7) v1(25.54,14.94) v1(25.5,4.47) v1(25.5,3.71) v1(25.5,2.95) v1(25.5,2.18) v1(25.5,1.42) v1(25.5,0.66) v1(26.17,17.22) v1(26.17,16.46) v1(26.17,15.7) v1(26.17,14.94) v1(26.17,14.18) v1(26.14,4.47) v1(26.14,3.71) v1(26.14,2.95) v1(26.14,2.18) v1(26.14,1.42) v1(26.14,0.66) v1(26.77,3.71) v1(26.77,2.95) v1(26.77,2.18) v1(26.77,1.42) v1(26.77,0.66) v1(26.81,17.22) v1(26.81,16.46) v1(26.81,15.7) v1(26.81,14.94) v1(26.81,14.18) v1(27.44,17.22) v1(27.44,16.46) v1(27.44,15.7) v1(27.44,14.94) v1(27.44,14.18) v1(27.41,4.47) v1(27.41,3.71) v1(27.41,2.95) v1(27.41,2.18) v1(27.41,1.42) v1(27.41,0.66) v1(28.08,17.22) v1(28.08,16.46) v1(28.08,15.7) v1(28.08,14.94) v1(28.08,14.18) v1(28.04,4.47) v1(28.04,3.71) v1(28.04,2.95) v1(28.04,2.18) v1(28.04,1.42) v1(28.04,0.66) v1(28.68,4.47) v1(28.68,3.71) v1(28.68,2.95) v1(28.68,2.18) v1(28.68,1.42) v1(28.68,0.66) v1(28.71,17.22) v1(28.71,16.46) v1(28.71,15.7) v1(28.71,14.94) v1(28.71,14.18) v1(29.35,17.22) v1(29.35,16.46) v1(29.35,15.7) v1(29.35,14.94) v1(29.35,14.18) v1(29.31,4.47) v1(29.31,3.71) v1(29.31,2.95) v1(29.31,2.18) v1(29.31,1.42) v1(29.31,0.66) v1(29.98,17.22) v1(29.98,16.46) v1(29.98,15.7) v1(29.98,14.94) v1(29.98,14.18) v1(29.95,4.47) v1(29.95,3.71) v1(29.95,2.95) v1(29.95,2.18) v1(29.95,1.42) v1(29.95,0.66)
VS3_C: length 28.6
  Top Layer w0.165: Q20.8 17.18,17.17 16.25,17.17 C61.2 ; U17.12 10.11,13.77 v1(11.48,13.77)
  Inner1 w0.165: v1(11.48,13.77) 12.09,13.16 12.09,11.53 10.77,10.21 10.77,7.33 12.35,5.74 15.98,5.74 v1(17.25,4.47)
  Inner2 w0.165: v1(11.48,13.77) 11.48,13.72 13.66,11.53 18.03,11.53
  vias: v1(11.4,6.64) v1(16.61,4.47) v1(16.61,3.71) v1(16.61,2.95) v1(16.61,2.18) v1(16.61,1.42) v1(16.61,0.66) v1(16.71,17.12) v1(16.71,16.36) v1(16.71,15.6) v1(16.71,14.83) v1(16.71,14.07) v1(17.25,3.71) v1(17.25,2.95) v1(17.25,2.18) v1(17.25,1.42) v1(17.25,0.66) v1(17.35,17.12) v1(17.35,16.36) v1(17.35,15.6) v1(17.35,14.83) v1(17.35,14.07) v1(17.88,4.47) v1(17.88,3.71) v1(17.88,2.95) v1(17.88,2.18) v1(17.88,1.42) v1(17.88,0.66) v1(17.98,17.12) v1(17.98,16.36) v1(17.98,15.6) v1(17.98,14.83) v1(17.98,14.07) v1(18.11,11.49) v1(18.52,4.47) v1(18.52,3.71) v1(18.52,2.95) v1(18.52,2.18) v1(18.52,1.42) v1(18.52,0.66) v1(18.62,17.12) v1(18.62,16.36) v1(18.62,15.6) v1(18.62,14.83) v1(18.62,14.07) v1(18.75,11.49) v1(19.15,4.47) v1(19.15,3.71) v1(19.15,2.95) v1(19.15,2.18) v1(19.15,1.42) v1(19.15,0.66) v1(19.25,17.12) v1(19.25,16.36) v1(19.25,15.6) v1(19.25,14.83) v1(19.25,14.07) v1(19.38,11.49) v1(19.79,4.47) v1(19.79,3.71) v1(19.79,2.95) v1(19.79,2.18) v1(19.79,1.42) v1(19.79,0.66) v1(19.89,17.12) v1(19.89,16.36) v1(19.89,15.6) v1(19.89,14.83) v1(19.89,14.07) v1(20,11.49) v1(20.42,4.47) v1(20.42,3.71) v1(20.42,2.95) v1(20.42,2.18) v1(20.42,1.42) v1(20.42,0.66) v1(20.52,17.12) v1(20.52,16.36) v1(20.52,15.6) v1(20.52,14.83) v1(20.52,14.07) v1(20.65,11.49) v1(21.06,4.47) v1(21.06,3.71) v1(21.06,2.95) v1(21.06,2.18) v1(21.06,1.42) v1(21.06,0.66) v1(21.16,17.12) v1(21.16,16.36) v1(21.16,15.6) v1(21.16,14.83) v1(21.16,14.07)
$1N858: length 2.4
  Top Layer w0.178: C36.2 41.34,38.86 41,38.86 40.55,39.3 U14.1
$1N859: length 9.4
  Top Layer w0.178: D3.1 39.83,40.49 39.83,39.01 40.61,38.23 40.68,38.23
  Top Layer w0.305: L2.1 37.15,39.34 D3.1 39.06,42.07 39.36,42.37 40.52,42.37 U14.6
$1N861: length 5.8
  Top Layer w0.305: U14.4 42.45,41.87 42.72,41.61 45.11,41.61 45.21,41.71 45.21,42.55 R7.1 R8.1
$1N862: length 1.7
  Top Layer w0.178: 5V.2 35.9,42.72 R9.1
$1N867: length 3.1
  Top Layer w0.178: U14.3 43.16,38.99 R6.1 R10.2
$1N1721: length 2.3
  Top Layer w0.178: C38.2 40.83,32.66 40.79,32.66 40.5,32.95 U15.1
$1N1722: length 8.4
  Top Layer w0.178: D4.1 39.12,32.98 C38.1
  Top Layer w0.305: U15.6 39.5,35.2 D4.1 37.49,33.58 L3.1
$1N1725: length 1.5
  Top Layer w0.305: LED4.2 32.46,27.68 R14.1
$1N1730: length 3.2
  Top Layer w0.178: U15.3 42.46,33.44 43.85,33.44 R11.1
$1N2053: length 1.3
  Top Layer w0.178: R50.1 19.84,43.04 3.3.2
$1N2347: length 1.4
  Top Layer w0.178: R51.1 22.35,44.13 A3.3.2
$1N3788: length 2.9
  Top Layer w0.165: 16.47,30.19 17.42,31.14 18.93,31.14 18.96,31.18
$1N4148: length 1.4
  Top Layer w0.191: LED7.2 12.36,25.02 11.38,25.02
$1N4149: length 1.7
  Top Layer w0.191: LED7.3 14.73,26.28 R69.1
$1N4150: length 3.6
  Top Layer w0.191: R70.2 14.78,25.17 14.78,24.73 LED7.4
$1N4337: length 7
  Top Layer w0.178: R5.1 34.91,48.01 34.34,47.45 34.34,45.74 U2.4
$1N4338: length 6.3
  Top Layer w0.178: 27.1,48.29 30.29,48.29 31.5,47.09 31.5,45.78 U2.10
$1N4538: length 2.4
  Bottom Layer w0.165: R65.2 26.72,30.28 U22.2
$1N4547: length 2.3
  Bottom Layer w0.165: R66.2 26.72,29.29 U22.3
$1N4548: length 2.5
  Bottom Layer w0.165: R67.2 28.27,28.8 U22.4
$1N7895: length 6.2
  Top Layer w0.165: C59.1 33.02,15.38 R76.2 33.68,14.42 33.68,12.4 34.65,11.42 Q11.4
$1N8788: length 5.9
  Top Layer w0.165: C60.1 24.13,16.52 R77.2 24.84,14.52 24.84,12.31 Q18.4
$1N9009: length 6
  Top Layer w0.165: Q19.4 15.95,12.31 15.95,14.72 R78.2 C61.1
$1N9028: length 6.8
  Top Layer w0.165: 31.39,16.65 C64.1 ; 31.39,16.65 R81.2 ; 31.39,16.65 31.39,16.71 32.16,17.48 32.16,18.95 32.36,19.15 34.69,19.15 Q16.4
$1N9079: length 8.3
  Top Layer w0.165: 13.41,16.67 12.55,17.53 12.55,18.44 13.51,19.41 16.53,19.41 Q20.4 ; 13.41,16.67 R79.2 ; 13.41,16.67 C62.1
$1N9346: length 6.2
  Top Layer w0.165: Q17.4 25.49,18.9 23.88,18.9 23.42,18.44 23.42,17.44 C63.1 22.61,15.33 R80.2
$1N10302: length 3.3
  Top Layer w0.165: 12.99,21.8 C65.2 ; 12.99,21.8 14.24,21.8 14.52,22.08 ; 12.99,21.8 R84.1
$1N10398: length 3
  Top Layer w0.178: R82.1 10.02,21.7 R83.2 11.45,20.24 R84.2
$1N15712: length 9.3
  Top Layer w0.178: U1.20 U1.21 23.59,26.9 23.59,25.4 23.13,24.94 22.4,24.94 21.9,24.43 19.15,24.43 18.64,24.94 17.78,24.94 17.29,24.46 R87.2

## Copper pours and planes (outline as drawn; the poured copper is in the pictures)
GND on Top Layer: 40.97,20.98 45.8,20.98 45.8,16.15 40.97,16.15
GND on Top Layer: -4.32,54.25 50.9,54.25 50.9,-2.13 -4.32,-2.13
GND on Bottom Layer: -6.71,56.03 56.9,56.03 56.9,-1.93 -6.71,-1.93
GND on Inner1: -2.64,54.36 52.32,54.36 52.32,-1.12 -2.64,-1.12
GND on Inner2: -4.47,55.12 52.32,55.12 52.32,-0.81 -4.47,-0.81
VBAT+ on Top Layer: 41.02,10.97 45.85,10.97 45.85,6.15 41.02,6.15
VBAT+ on Top Layer: 45.55,10.68 45.12,11.1 41.02,11.1 40.13,10.21 16.05,10.21 16.05,5.89 45,5.89 45.55,6.44
VBAT+ on Top Layer: 44.27,30.35 46.29,30.35 46.29,21.64 44.27,21.64
A+ on Top Layer: 35.7,19.42 36.48,20.2 36.71,20.2 37.4,20.89 37.4,21.32 39.08,21.32 39.37,21.03 39.37,18.85 38.96,18.44 35.71,18.44 35.66,18.49 35.66,19.41 35.7,19.44
A- on Top Layer: 37.39,27.28 39.56,27.28 39.56,23.02 37.39,23.02
A- on Top Layer: 40.08,23.98 37.08,23.98 36.58,24.49 32.66,24.49 32.16,23.98 29.25,23.98 28.75,24.48 25.9,24.48 24.89,23.33 22.76,23.33 24.33,25.1 39.42,25.1 40.08,24.43
B+ on Top Layer: 26.52,18.75 26.72,18.54 29.88,18.54 31.31,19.96 31.86,19.96 31.86,21.43 29.82,21.43 29.82,20.93 28.91,20.02 27.08,20.02 26.52,19.46
C+ on Top Layer: 17.63,18.64 17.63,19.51 17.83,19.71 20.73,19.71 21.9,20.87 21.9,21.39 21.96,21.45 23.18,21.45 23.71,20.92 23.71,19.9 23.57,19.76 23.02,19.76 22.62,19.35 22.25,19.35 21.44,18.54 17.73,18.54
VS1_A on Top Layer: 35.61,10.92 35.61,11.79 35.56,11.84 35.56,12.8 35.36,13 34.68,13 34.25,13.43 34.25,17.44 34.44,17.63 39.12,17.63 39.27,17.48 39.27,11.3 38.89,10.92
VS1_A on Top Layer: 33.54,5.05 40.08,5.05 40.08,-0.15 33.54,-0.15
VS1_A on Bottom Layer: 33.96,17.48 39.62,17.48 39.62,0.24 33.96,0.24
VS2_B on Top Layer: 26.47,11.02 26.47,12.8 26.16,13.11 25.58,13.11 25.16,13.53 25.16,17.49 25.45,17.78 29.97,17.78 30.23,17.53 30.23,11.1 30.02,10.9 26.59,10.9
VS2_B on Top Layer: 24.58,5.04 31.09,5.04 31.09,-0.25 24.58,-0.25
VS2_B on Bottom Layer: 24.89,17.32 30.54,17.32 30.54,0.08 24.89,0.08
VS3_C on Top Layer: 15.66,5 22.15,5 22.15,-0.15 15.66,-0.15
VS3_C on Top Layer: 17.83,10.92 21.03,10.92 21.34,11.23 21.34,17.27 21.08,17.53 16.51,17.53 16.31,17.32 16.31,13.16 16.51,12.95 17.42,12.95 17.58,12.8 17.58,11.18
VS3_C on Bottom Layer: 16.01,17.37 21.59,17.37 21.59,0.3 16.01,0.3

## Text on the board
Top Silkscreen Layer: MISO | MOSI | SCK | SPI | G | SWD | UART | I2C | CAN | SDA | RX | H | CLK | 5V | + | -
